# Altium schematic sheet CH32V205RCT-R0.SchDoc
size 406 x 281 mm; SheetNumber: 1; SheetTotal: 1
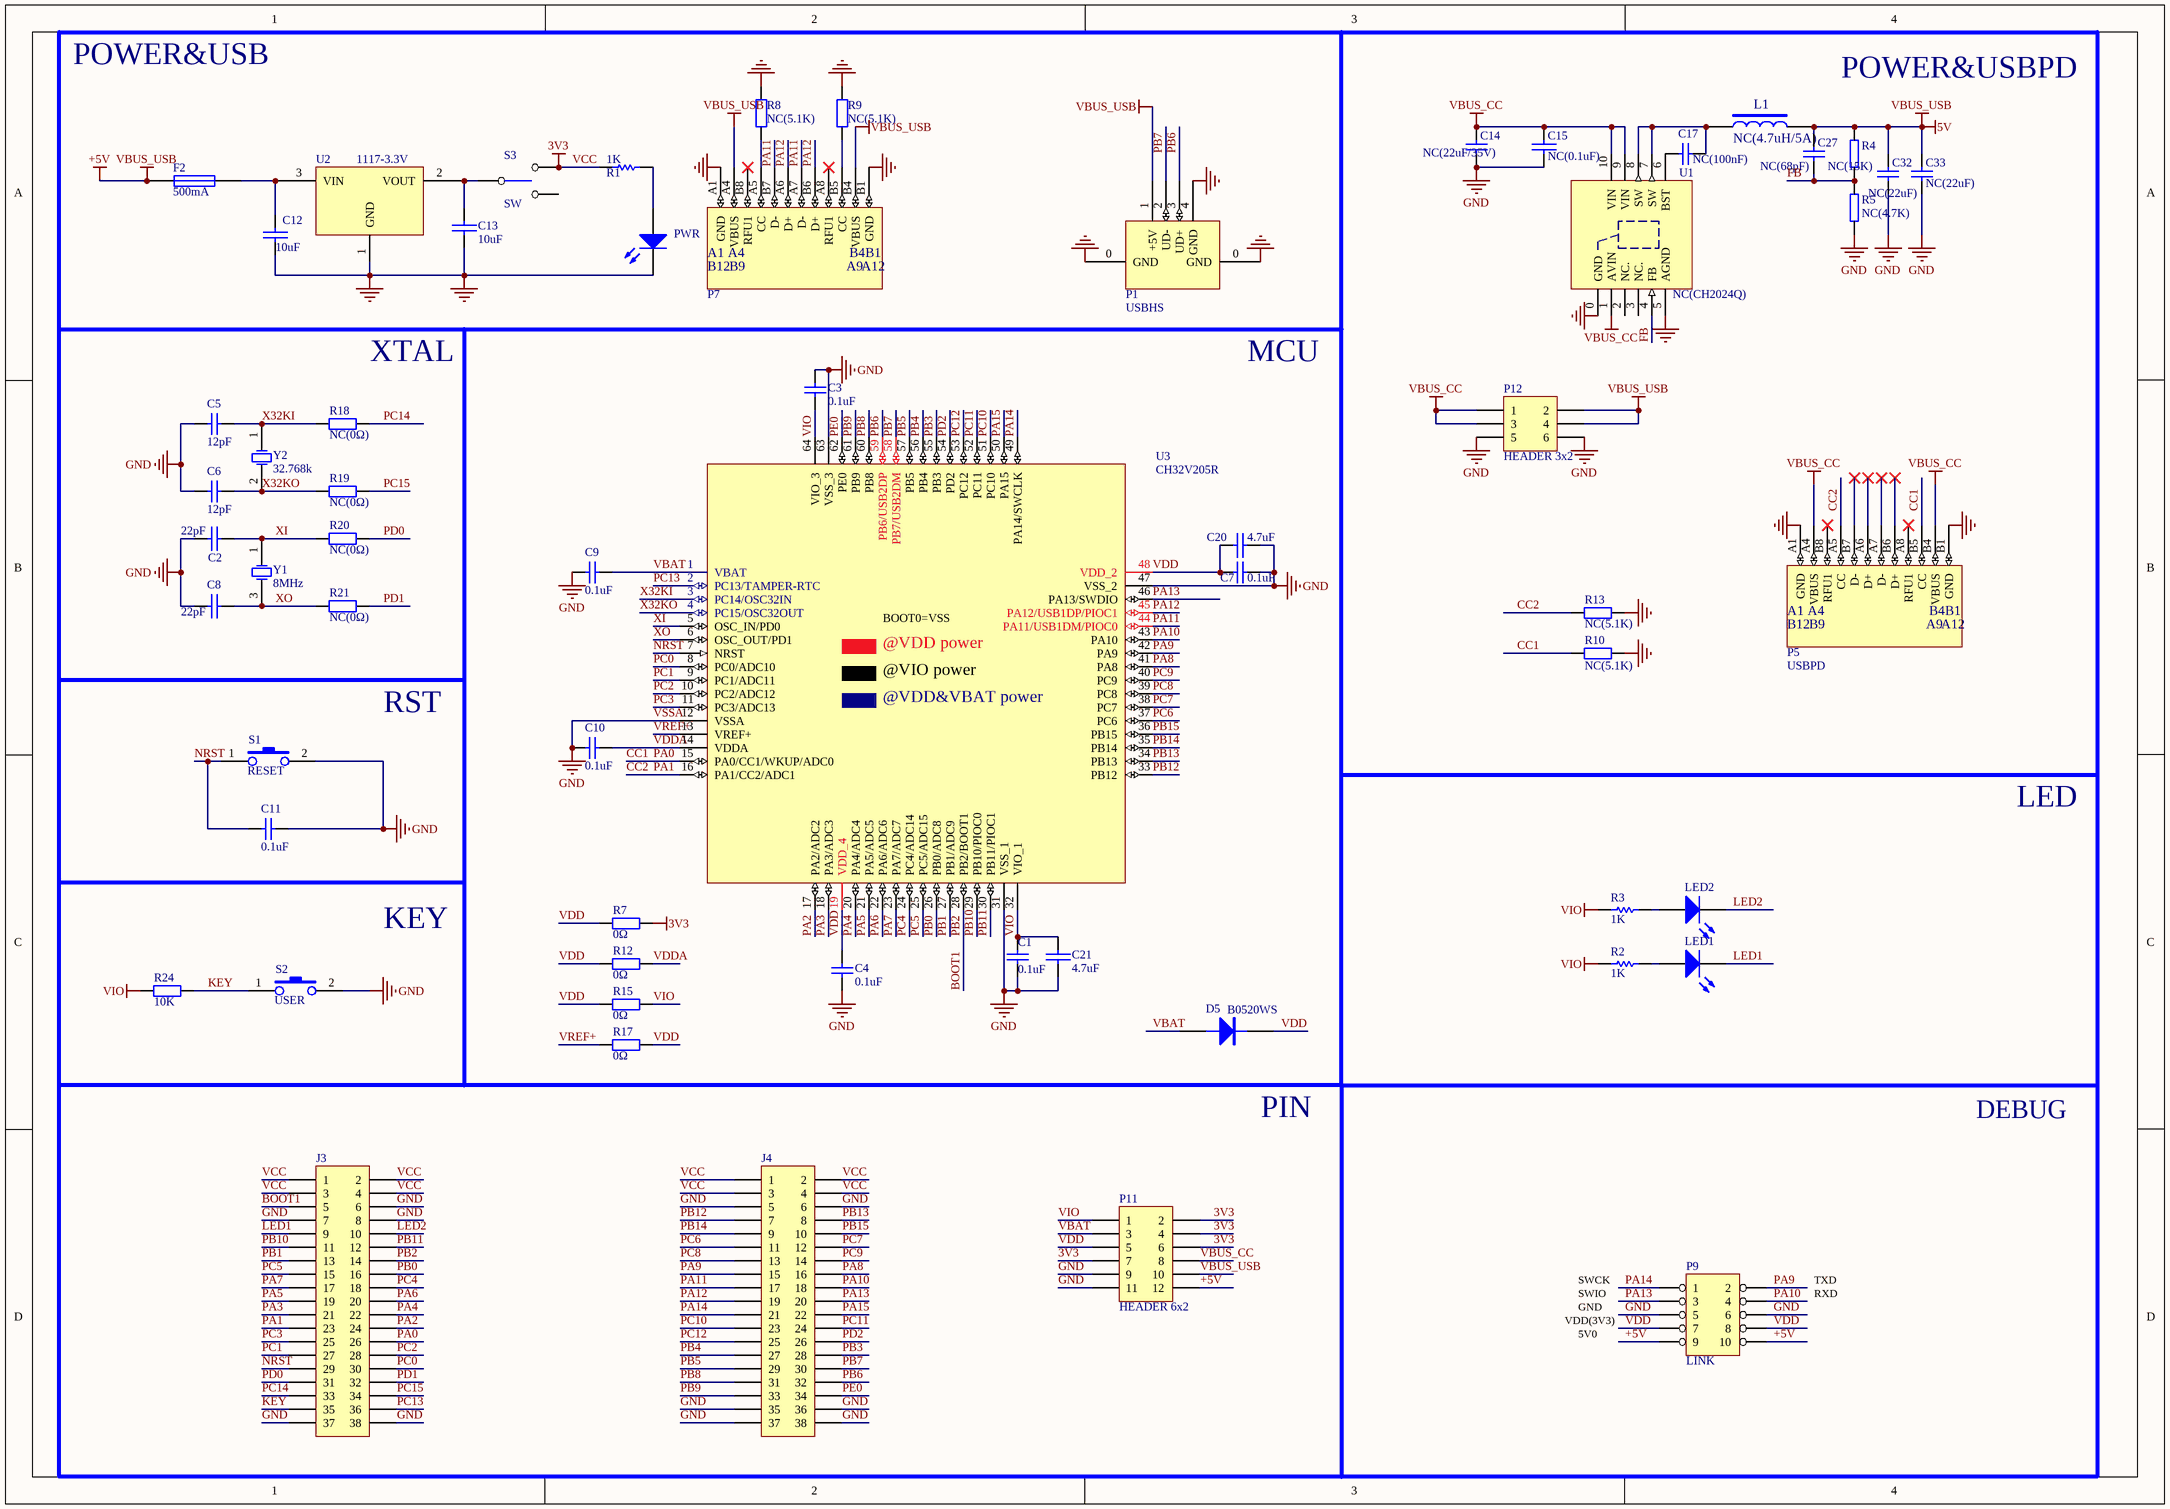
[diagram p0: CH32V205RCT-R0.SchDoc]

## Parts
C1  0.1uF  [0402_C]
C2  22pF  [0402_C]
C3  0.1uF  [0402_C]
C4  0.1uF  [0402_C]
C5  12pF  [0402_C]
C6  12pF  [0402_C]
C7  0.1uF  [0402_C]
C8  22pF  [0402_C]
C9  0.1uF  [0402_C]
C10  0.1uF  [0402_C]
C11  0.1uF  [0402_C]
C12  10uF  [0603_C]
C13  10uF  [0603_C]
C14  NC(22uF/35V)  [0805_C]
C15  NC(0.1uF)  [0402_C]
C17  NC(100nF)  [0402_C]
C20  4.7uF  [0402_C]
C21  4.7uF  [0402_C]
C27  NC(68pF)  [0402_C]
C32  NC(22uF)  [0805_C]
C33  NC(22uF)  [0805_C]
D5  B0520WS  [SOD-323]
F2  500mA  [0603]
J3  Header 19X2  [IDC38-2.54mm]  (value not drawn)
J4  Header 19X2  [IDC38-2.54mm]  (value not drawn)
L1  NC(4.7uH/5A)  [IND-SMD_L7.0-W6.6]
LED1  LED1   blue  [0603+]  (value not drawn)
LED2  LED2  blue  [0603+]  (value not drawn)
P1  USBHS  [USBAF]
P5  USBPD  [TYPE-C-Receptacle-2.0]
P7  TYPE-C  [TYPE-C-Receptacle-2.0]  (value not drawn)
P9  LINK  [IDC10-2.54mm]
P11  HEADER 6x2  [IDC12-2.54mm]
P12  HEADER 3x2  [IDC6-2.54mm]
PWR  POWER  red  [0603+]  (value not drawn)
R1  1K  [0402]
R2  1K  [0402]
R3  1K  [0402]
R4  NC(15K)  [0402]
R5  NC(4.7K)  [0402]
R7  0Ω  [0402]
R8  NC(5.1K)  [0402]
R9  NC(5.1K)  [0402]
R10  NC(5.1K)  [0402]
R12  0Ω  [0402]
R13  NC(5.1K)  [0402]
R15  0Ω  [0402]
R17  0Ω  [0402]
R18  NC(0Ω)  [0402]
R19  NC(0Ω)  [0402]
R20  NC(0Ω)  [0402]
R21  NC(0Ω)  [0402]
R24  10K  [0402]
S1  RESET  [SMD_6.1x3.65x2.5mm-KEY]
S2  USER  [SMD_6.1x3.65x2.5mm-KEY]
S3  SW  [SW1]
U1  NC(CH2024Q)  [DFN10_3X3]
U2  1117-3.3V  [SOT-223]
U3  CH32V205R  [LQFP64_7X7]
Y1  8MHz  [XT3225]
Y2  32.768k  [FC-135]

## Nets
3V3: J3.1 J3.2 J3.3 J3.4 J4.1 J4.2 J4.3 J4.4 P11.2 P11.4 P11.6 P11.7 R1.2 R7.1 S3.3  [also labelled VCC]
+5V: C27.1 C32.2 C33.2 F2.1 L1.2 P1.1(+5V) P7.A4(VBUS) P7.B4(VBUS) P9.9 P9.10 P11.10 P11.12 P12.2 P12.4 R4.2  [also labelled 5V, VBUS_USB]
GND: C1.1 C2.1 C3.1 C4.1 C5.2 C6.2 C7.1 C8.1 C9.2 C10.2 C11.1 C12.2 C13.2 C14.1 C15.1 C20.2 C21.1 C32.1 C33.1 J3.6 J3.7 J3.8 J3.37 J3.38 J4.5 J4.6 J4.35 J4.36 J4.37 J4.38 P1.0(GND) P1.4(GND) P5.A1(GND) P5.B1(GND) P7.A1(GND) P7.B1(GND) P9.5 P9.6 P11.9 P11.11 P12.5 P12.6 PWR.2(K) R5.1 R8.1 R9.1 R10.2 R13.2 S1.2 S2.2 U1.0(GND) U1.5(AGND) U2.1(GND) U3.12(VSSA) U3.31(VSS_1) U3.47(VSS_2) U3.63(VSS_3)  [also labelled VSSA]
VBUS_CC: C14.2 C15.2 P5.A4(VBUS) P5.B4(VBUS) P11.8 P12.1 P12.3 U1.1(AVIN) U1.9(VIN) U1.10(VIN)
VIO: C1.2 C3.2 C21.2 P11.1 R2.1 R3.1 R15.1 R24.2 U3.32(VIO_1) U3.64(VIO_3)
BOOT1: J3.5 J3.14 U3.28(PB2/BOOT1)  [also labelled PB2]
CC1: J3.26 P5.B5(CC) R10.1 U3.15(PA0/CC1/WKUP/ADC0)  [also labelled PA0]
CC2: J3.23 P5.A5(CC) R13.1 U3.16(PA1/CC2/ADC1)  [also labelled PA1]
FB: C27.2 R4.1 R5.2 U1.4(FB)
KEY: J3.35 R24.1 S2.1
LED1: J3.9 LED1.2(K)
LED2: J3.10 LED2.2(K)
NRST: C11.2 J3.29 S1.1 U3.7(NRST)
PA2: J3.24 U3.17(PA2/ADC2)
PA3: J3.21 U3.18(PA3/ADC3)
PA4: J3.22 U3.20(PA4/ADC4)
PA5: J3.19 U3.21(PA5/ADC5)
PA6: J3.20 U3.22(PA6/ADC6)
PA7: J3.17 U3.23(PA7/ADC7)
PA8: J4.16 U3.41(PA8)
PA9: J4.15 P9.2 U3.42(PA9)
PA10: J4.18 P9.4 U3.43(PA10)
PA11: J4.17 P7.A7(D-) P7.B7(D-) U3.44(PA11/USB1DM/PIOC0)
PA12: J4.19 P7.A6(D+) P7.B6(D+) U3.45(PA12/USB1DP/PIOC1)
PA13: J4.20 P9.3 U3.46(PA13/SWDIO)
PA14: J4.21 P9.1 U3.49(PA14/SWCLK)
PA15: J4.22 U3.50(PA15)
PB0: J3.16 U3.26(PB0/ADC8)
PB1: J3.13 U3.27(PB1/ADC9)
PB3: J4.28 U3.55(PB3)
PB4: J4.27 U3.56(PB4)
PB5: J4.29 U3.57(PB5)
PB6: J4.32 P1.3(UD+) U3.59(PB6/USB2DP)
PB7: J4.30 P1.2(UD-) U3.58(PB7/USB2DM)
PB8: J4.31 U3.60(PB8)
PB9: J4.33 U3.61(PB9)
PB10: J3.11 U3.29(PB10/PIOC0)
PB11: J3.12 U3.30(PB11/PIOC1)
PB12: J4.7 U3.33(PB12)
PB13: J4.8 U3.34(PB13)
PB14: J4.9 U3.35(PB14)
PB15: J4.10 U3.36(PB15)
PC0: J3.30 U3.8(PC0/ADC10)
PC1: J3.27 U3.9(PC1/ADC11)
PC2: J3.28 U3.10(PC2/ADC12)
PC3: J3.25 U3.11(PC3/ADC13)
PC4: J3.18 U3.24(PC4/ADC14)
PC5: J3.15 U3.25(PC5/ADC15)
PC6: J4.11 U3.37(PC6)
PC7: J4.12 U3.38(PC7)
PC8: J4.13 U3.39(PC8)
PC9: J4.14 U3.40(PC9)
PC10: J4.23 U3.51(PC10)
PC11: J4.24 U3.52(PC11)
PC12: J4.25 U3.53(PC12)
PC13: J3.36 U3.2(PC13/TAMPER-RTC)
PC14: J3.33 R18.2
PC15: J3.34 R19.1
PD0: J3.31 R20.1
PD1: J3.32 R21.1
PD2: J4.26 U3.54(PD2)
PE0: J4.34 U3.62(PE0)
VBAT: C9.1 D5.1(A) P11.3 U3.1(VBAT)
VDD: C4.2 C7.2 C20.1 D5.2(K) P9.7 P9.8 P11.5 R7.2 R12.2 R15.2 R17.1 U3.19(VDD_4) U3.48(VDD_2)
VDDA: C10.1 R12.1 U3.14(VDDA)
VREF+: R17.2 U3.13(VREF+)
X32KI: C5.1 R18.1 U3.3(PC14/OSC32IN) Y2.1(OSC1)
X32KO: C6.1 R19.2 U3.4(PC15/OSC32OUT) Y2.2(OSC2)
XI: C2.2 R20.2 U3.5(OSC_IN/PD0) Y1.1(OSC1)
XO: C8.2 R21.2 U3.6(OSC_OUT/PD1) Y1.3(OSC2)
NetC12_1: C12.1 F2.2 U2.3(VIN)
NetC13_1: C13.1 S3.1 U2.2(VOUT)
NetC17_1: C17.1 U1.6(BST)
NetC17_2: C17.2 L1.1 U1.7(SW) U1.8(SW)
NetLED1_1: LED1.1(A) R2.2
NetLED2_1: LED2.1(A) R3.2
NetP7_A5: P7.A5(CC) R8.2
NetP7_B5: P7.B5(CC) R9.2
NetPWR_1: PWR.1(A) R1.1

Not connected (* = marked no-connect by the designer): P5 A6(D+)* A7(D-)* A8(RFU1)* B6(D+)* B7(D-)* B8(RFU1)*; P7 A8(RFU1)* B8(RFU1)*; S3 2; U1 2(NC.) 3(NC.)

## Notes on the sheet
- POWER&USB
- POWER&USBPD
- XTAL
- MCU
- RST
- LED
- KEY
- PIN
- DEBUG
- VDD(3V3)
- SWCK
- SWIO
- GND
- TXD
- RXD
- 5V0
- Title
- Size:
- Date:
- A3
- Number:
- Time:
- Revision:
- Sheet
- of
- File:
- (in symbol CH32V205R) BOOT0=VSS; @VDD power; @VIO power; @VDD&VBAT power
- (in symbol TYPE-C1) B12; B9; A9; A12

## Library data of the parts
C1 C3-C7 C9-C11 = Cap: Capacitor
C2 C8 C12 C13 C15 C20 C21 = CAP: Capacitor
C14 C27 C32 C33 = 0603 100nF (104) 10% 50V: 贴片电容; ComponentLink1Description: 供应商链接; ComponentLink1URL: http://www.szlcsc.com/product/details_15331.html; Package: 0603; Supplier: LC; SuppliersPartNumber: C14663
C17 = 0603 1uF (105) 10% 50V: 贴片电容; ComponentLink1Description: 供应商链接; ComponentLink1URL: http://www.szlcsc.com/product/details_16531.html; Package: 0603; Supplier: LC; SuppliersPartNumber: C15849
D5 = DIODE
F2 = FUSE1: Fuse
J3 J4 = Header 19X2: Header, 19-Pin, Dual row; LatestRevisionDate: 17-Jul-2002; LatestRevisionNote: Re-released for DXP Platform.; Publisher: Altium Limited
L1 = INDUCTOR
LED1 LED2 PWR = LED0: Typical INFRARED GaAs LED; Published: 8-Jun-2000; LatestRevisionDate: 08-Jul-2005; LatestRevisionNote: Mech Layer 1 removed.; PackageReference: LED-0; Publisher: Altium Limited
P1 = USB: USB Port
P5 P7 = TYPE-C1
P9 = HEADER 5x2: Header, 5-Pin, Dual row
P11 = HEADER 6x2: Header, 6-Pin, Dual row
P12 = HEADER 3x2: Header, 3-Pin, Dual row
R1-R3 = Res Semi: Semiconductor Resistor
R4 R5 = RES
R7-R10 R12 R13 R15 R17-R21 R24 = Res2: Resistor
S1 S2 = KEY1
U1 = CH2024Q: Step-Down DC-DC Converter, 28V input, FB 1.2V, 3A output
U3 = CH32V205R: RISC-V MCU, 192MHz, USB_480M, USB FS, PD, PIOC, ADC, TKEY, 2*OPA, 2*CMP
Y1 Y2 = XTAL: Crystal Oscillator; Published: 8-Jun-2000; LatestRevisionDate: 17-Jul-2002; LatestRevisionNote: Re-released for DXP Platform.; PackageReference: R38; Publisher: Altium Limited
  Y1: PackageDescription: Crystal, Thru-Hole; 2 Leads; Body 3.1 x 8.2 mm (Dia.xH)